# Altium schematic sheet [15]-FPGA_Bank_8_Interface.SchDoc
size A4
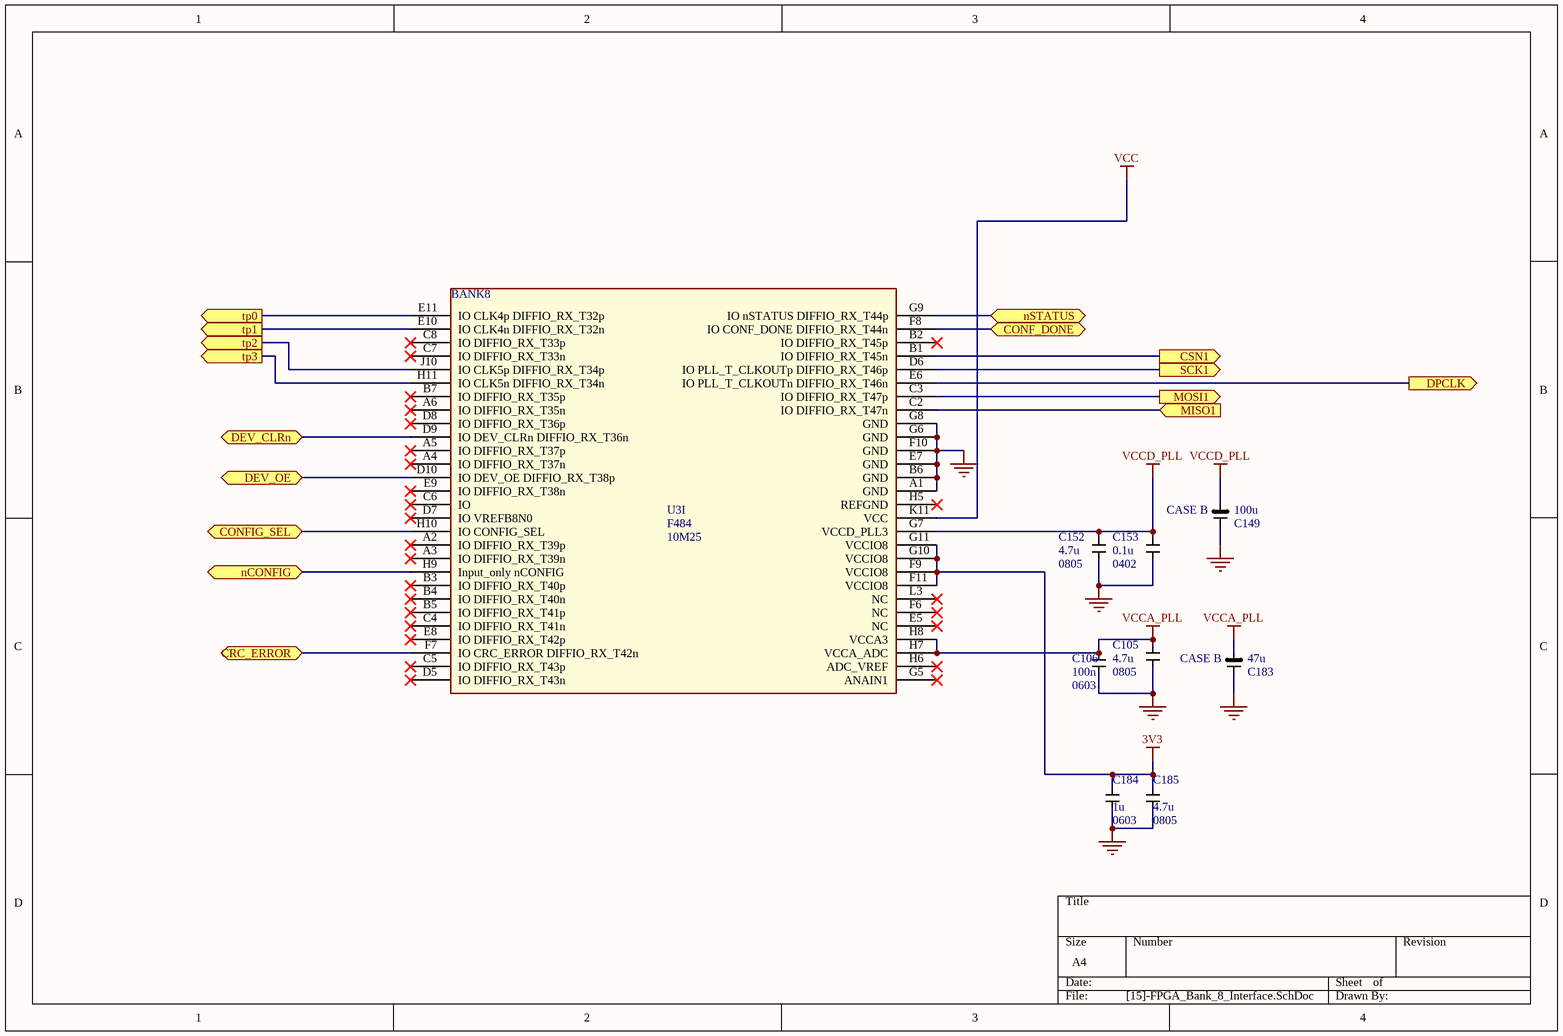
[diagram p0: [15]-FPGA_Bank_8_Interface.SchDoc]

## Parts
C105  4.7u  PCB footprint: 0805
C106  100n  PCB Layer:: 0603  [*0603]
C149  100u  CASE: CASE B  [CAPC3529X21N]
C152  4.7u  PCB footprint: 0805
C153  0.1u  PCB footprint: 0402
C183  47u  CASE: CASE B  [CAPC3529X21N]
C184  1u  PCB Layer:: 0603  [*0603]
C185  4.7u  PCB Package: 0805  [*CAPC2013X140N]
U3  10M25  Package Type: F484  [*BGA484C100P22X22_2300X2300X200N]  (part I of 9)

## Ports
CONF_DONE (bidir), CONFIG_SEL (bidir), CRC_ERROR (bidir), CSN1 (out), DEV_CLRn (bidir), DEV_OE (bidir), DPCLK (out), MISO1 (in), MOSI1 (out), nCONFIG (bidir), nSTATUS (bidir), SCK1 (out), tp0 (out), tp1 (out), tp2 (out), tp3 (out)

## Nets
3V3: C184.2 C185.2 U3.F9(VCCIO8) U3.F11(VCCIO8) U3.G10(VCCIO8) U3.G11(VCCIO8)
GND: C105.1 C106.1 C149.2 C152.1 C153.1 C183.2 C184.1 C185.1 U3.A1(GND) U3.B6(GND) U3.E7(GND) U3.F10(GND) U3.G6(GND) U3.G8(GND)
VCC: U3.K11(VCC)
VCCA_PLL: C105.2 C106.2 C183.1 U3.H7(VCCA_ADC) U3.H8(VCCA3)
VCCD_PLL: C149.1 C152.2 C153.2 U3.G7(VCCD_PLL3)
CONF_DONE: U3.F8(IO_CONF_DONE_DIFFIO_RX_T44n) ; port CONF_DONE
CONFIG_SEL: U3.H10(IO_CONFIG_SEL) ; port CONFIG_SEL
CRC_ERROR: U3.F7(IO_CRC_ERROR_DIFFIO_RX_T42n) ; port CRC_ERROR
CSN1: U3.B1(IO_DIFFIO_RX_T45n) ; port CSN1
DEV_CLRn: U3.D9(IO_DEV_CLRn_DIFFIO_RX_T36n) ; port DEV_CLRn
DEV_OE: U3.D10(IO_DEV_OE_DIFFIO_RX_T38p) ; port DEV_OE
DPCLK: U3.E6(IO_PLL_T_CLKOUTn_DIFFIO_RX_T46n) ; port DPCLK
MISO1: U3.C2(IO_DIFFIO_RX_T47n) ; port MISO1
MOSI1: U3.C3(IO_DIFFIO_RX_T47p) ; port MOSI1
nCONFIG: U3.H9(Input_only_nCONFIG) ; port nCONFIG
nSTATUS: U3.G9(IO_nSTATUS_DIFFIO_RX_T44p) ; port nSTATUS
SCK1: U3.D6(IO_PLL_T_CLKOUTp_DIFFIO_RX_T46p) ; port SCK1
tp0: U3.E11(IO_CLK4p_DIFFIO_RX_T32p) ; port tp0
tp1: U3.E10(IO_CLK4n_DIFFIO_RX_T32n) ; port tp1
tp2: U3.J10(IO_CLK5p_DIFFIO_RX_T34p) ; port tp2
tp3: U3.H11(IO_CLK5n_DIFFIO_RX_T34n) ; port tp3

Not connected (* = marked no-connect by the designer): U3 A2(IO_DIFFIO_RX_T39p)* A3(IO_DIFFIO_RX_T39n)* A4(IO_DIFFIO_RX_T37n)* A5(IO_DIFFIO_RX_T37p)* A6(IO_DIFFIO_RX_T35n)* B2(IO_DIFFIO_RX_T45p)* B3(IO_DIFFIO_RX_T40p)* B4(IO_DIFFIO_RX_T40n)* B5(IO_DIFFIO_RX_T41p)* B7(IO_DIFFIO_RX_T35p)* C4(IO_DIFFIO_RX_T41n)* C5(IO_DIFFIO_RX_T43p)* C6(IO)* C7(IO_DIFFIO_RX_T33n)* C8(IO_DIFFIO_RX_T33p)* D5(IO_DIFFIO_RX_T43n)* D7(IO_VREFB8N0)* D8(IO_DIFFIO_RX_T36p)* E5(NC)* E8(IO_DIFFIO_RX_T42p)* E9(IO_DIFFIO_RX_T38n)* F6(NC)* G5(ANAIN1)* H5(REFGND)* H6(ADC_VREF)* L3(NC)*

## Notes on the sheet
- (in symbol Component_1, part I) BANK8

## Library data of the parts
C105 C106 C149 C152 C153 C183-C185 = Component_1
  C105 C152 C153: Buying URL:: NEED TO BE ADDED
  C106 C184: Buying URL:: https://uk.farnell.com/avx/0603yc105kat2a/cap-1-f-16v-10-x7r-0603/dp/1658870RL?st=1u%200603
  C149 C183: Buying URL:: https://uk.farnell.com/avx/tajb107k006tnj/cap-tant-aec-q200-100uf-6-3v-case/dp/2893386?st=100u%20CASE%20B
  C185: Buying URL:: https://uk.farnell.com/avx/08053d475kat2a/cap-4-7-f-25v-10-x5r-0805/dp/1657932?st=4.7u%200805
U3 = Component_1: Part no.: 10M25DAF484I7G